# EAGLE design Esp8266-01_Luxmetre (EAGLE 9.5.2)
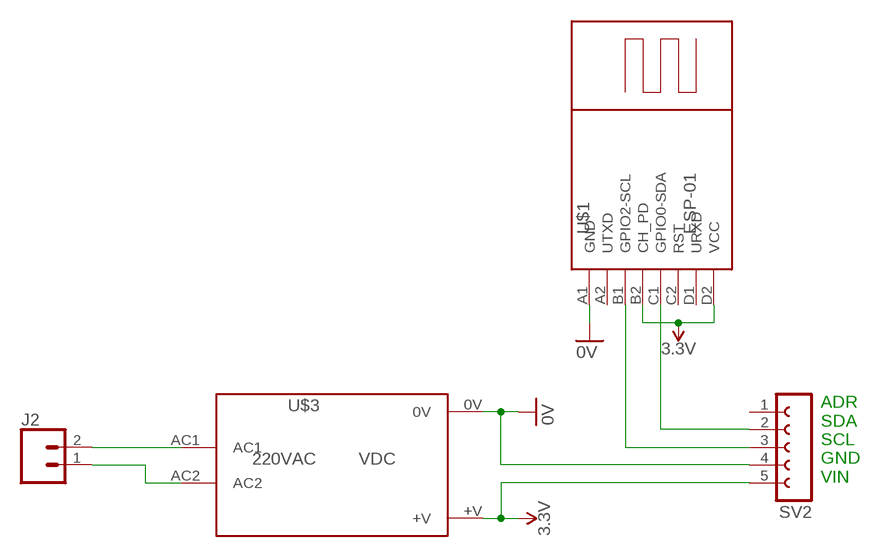
[diagram p0: schematic, sheet 1]

## Parts
J2  CONN_025MM  [BORNIER_A_VIS_2_5.12MM]
SV2  FE05-1  [FE05-1]
U$1  ESP-01  [ESP-01]
U$3  TSP05-5V-3W  [TSP05-VDC-3W]

## Nets
0V: SV2.4 U$1.A1(GND) U$3.0V
3.3V: SV2.5 U$1.B2(CH_PD) U$1.D2(VCC) U$3.+V
N$1: J2.2 U$3.AC1
N$2: J2.1 U$3.AC2
N$3: SV2.3 U$1.B1(GPIO2-SCL)
N$4: SV2.2 U$1.C1(GPIO0-SDA)
Unconnected: SV2.1 U$1.A2(UTXD) U$1.C2(RST) U$1.D1(URXD)

## Notes on the sheet
- ADR
  SDA
  SCL
  GND
  VIN

## Library data of the parts
J2 = _Remy:CONN_02: Multi connection point. Often used as Generic Header-pin footprint for 0.1 inch spaced/style header connections On any of the 0.1 inch spaced packages, you can populate with these: Break Away Headers - Straight <https://www.sparkfun.com/products/116> (PRT-00116) Break Away Male Headers - Right Angle <https://www.sparkfun.com/products/553> (PRT-00553) Female Headers <https://www.sparkfun.com/products/115> (PRT-00115) Break Away Headers - Machine Pin <https://www.sparkfun.com/products/117> (PRT-00117) Break Away Female Headers - Swiss Machine Pin <https://www.sparkfun.com/products/743> (PRT-00743) For SCREWTERMINALS and SPRING TERMINALS visit here: Screw Terimnals on SparkFun.com <https://www.sparkfun.com/search/results?term=Screw+Terminals> (5mm/3.5mm/2.54mm spacing) This device is also useful as a general connection point to wire up your design to another part of your project. Our various solder wires solder well into these plated through hole pads. Hook-Up Wire - Assortment (Stranded, 22 AWG) <https://www.sparkfun.com/products/11375> (PRT-11375) Hook-Up Wire - Assortment (Solid Core, 22 AWG) <https://www.sparkfun.com/products/11367> (PRT-11367) View the entire wire category on our website here <https://www.sparkfun.com/categories/141> Special notes: Molex polarized connector foot print use with: PRT-08233 with associated crimp pins and housings. 2.54_SCREWTERM for use with PRT-10571. 3.5mm Screw Terminal footprints for PRT-08084 5mm Screw Terminal footprints for use with PRT-08432; SF_SKU: PRT-08432
SV2 = _Remy:FE05-1: FEMALE HEADER
U$1 = _Remy:ESP-01: Wireless Wi-Fi ESP-01 Module based on ESP8266 chip Click here to find device on ebay.com <http://www.ebay.com/sch/esp8266+esp+01+transceiver>
U$3 = _Remy:TSP05-5V-3W

## Board
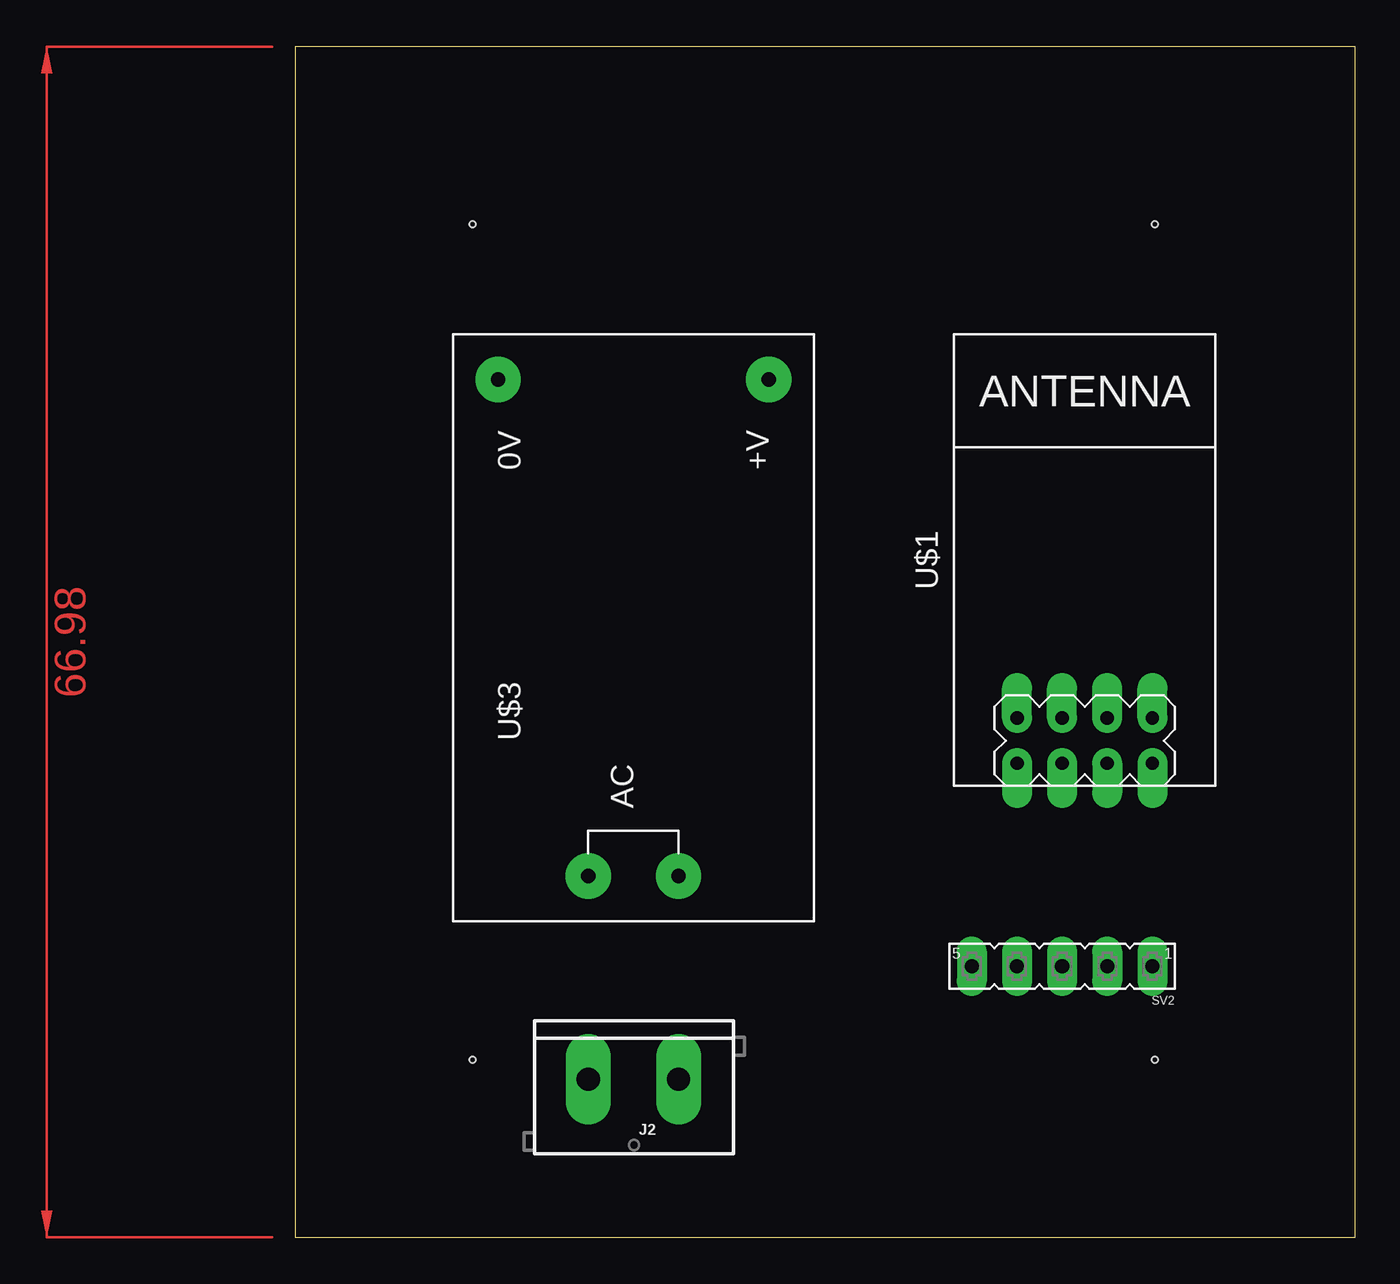
[diagram p1: board, top side]
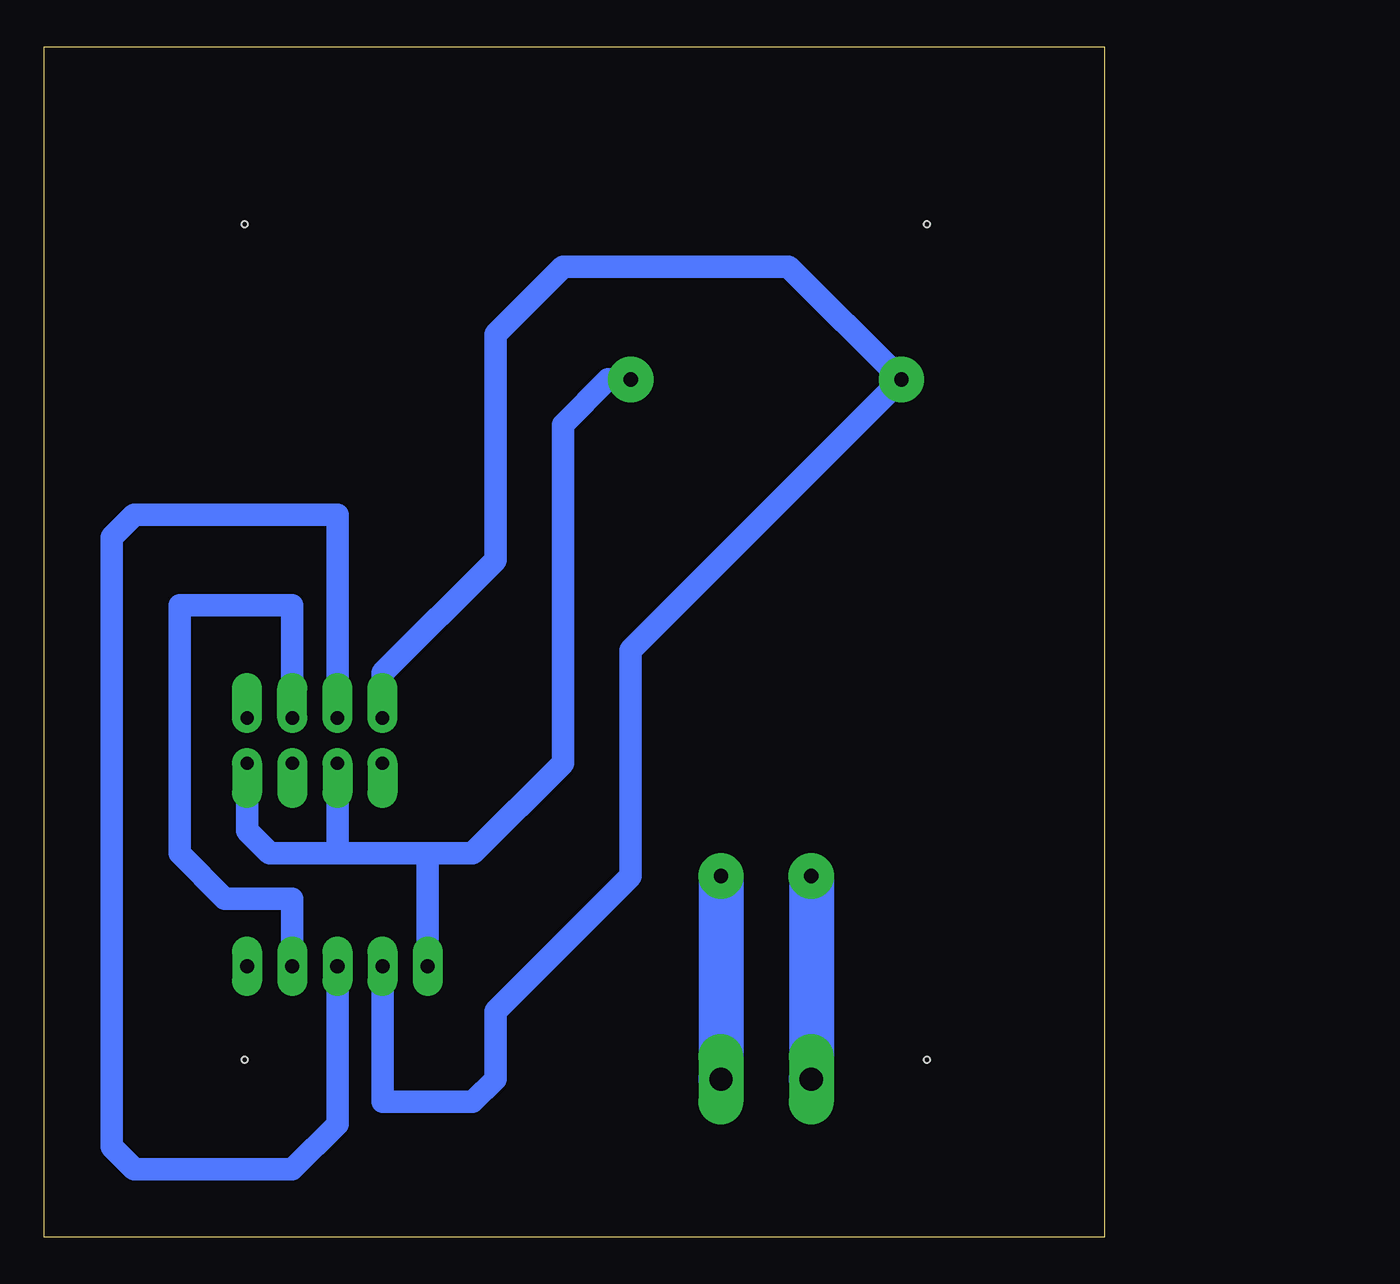
[diagram p2: board, bottom side, seen from below]

Size 59.67 x 66.98 mm. Coordinates in mm from the lower left corner, seen from the top.
Outline: 0,0 59.67,0 59.67,66.98 0,66.98 0,0
Copper layers (1*16): Top 0.035mm / dielectric 0.15mm / Bottom 0.035mm
Design rules "FastGcode-DesignRules": minimum track width 6mil, minimum drill 0.35mm, track to track 6mil, track to pad 6mil, pad to pad 6mil, via to via 6mil, smd to smd 6mil, copper to edge 31mil, drill to drill 6mil, minimum pad ring 5mil, minimum via ring 8mil, stop-mask expansion 4mil, vias tented up to drill 0mil, thermal gap 165mil
Holes 0.35 mm at 10,9.99 10,56.99 48.4,9.99 48.4,56.99

### Footprints (pad centres in the part's own frame; a part is rotated, then mirrored left to right if it is on the bottom)
BORNIER_A_VIS_2_5.12MM = drill 1.3 pad 2.54 long: 1 -2.54,0; 2 2.54,0
FE05-1 = drill 0.8 pad 1.676 long: 1 -5.08,0; 2 -2.54,0; 3 0,0; 4 2.54,0; 5 5.08,0
ESP-01 = drill 0.75 pad 1.676 offset: A1 -8.89,3.81; A2 -11.43,3.81; B1 -8.89,1.27; B2 -11.43,1.27; C1 -8.89,-1.27; C2 -11.43,-1.27; D1 -8.89,-3.81; D2 -11.43,-3.81
TSP05-VDC-3W = drill 0.8 pad 2.54: 0V 13.97,7.62; +V 13.97,-7.62; AC1 -13.97,2.54; AC2 -13.97,-2.54

### Placement (x,y rotation side)
J2  19.05,8.89 180 top
SV2  43.18,15.24 180 top
U$1  44.45,38.1 90 top
U$3  19.05,34.29 90 top

### Tracks (layer width: path | path; a pad name or v marks a point on that pad's centre or on a via)
0V
  Bottom 1.27: SV2.4 40.64,7.62 35.56,7.62 34.29,8.89 34.29,12.7 26.67,20.32 26.67,33.02 U$3.0V 17.78,54.61 30.48,54.61 34.29,50.8 34.29,38.1 40.64,31.75 U$1.A1
3.3V
  Bottom 1.27: 43.18,25.4 U$1.B2 43.18,21.59 | 38.1,21.59 SV2.5 | U$3.+V 27.94,48.26 30.48,45.72 30.48,26.67 35.56,21.59 38.1,21.59 | U$1.D2 48.26,22.86 46.99,21.59 43.18,21.59 | 43.18,21.59 38.1,21.59
N$1
  Bottom 2.54: U$3.AC1 J2.2
N$2
  Bottom 2.54: U$3.AC2 J2.1
N$3
  Bottom 1.27: U$1.B1 43.18,40.64 54.61,40.64 55.88,39.37 55.88,5.08 54.61,3.81 45.72,3.81 43.18,6.35 SV2.3
N$4
  Bottom 1.27: U$1.C1 45.72,35.56 52.07,35.56 52.07,21.59 49.53,19.05 45.72,19.05 SV2.2
(copper drawn outside any net)
  shapes: Top area x2